# EAGLE design Lichtobjekt (EAGLE 7.5.0)

## Sheet 1 of 2
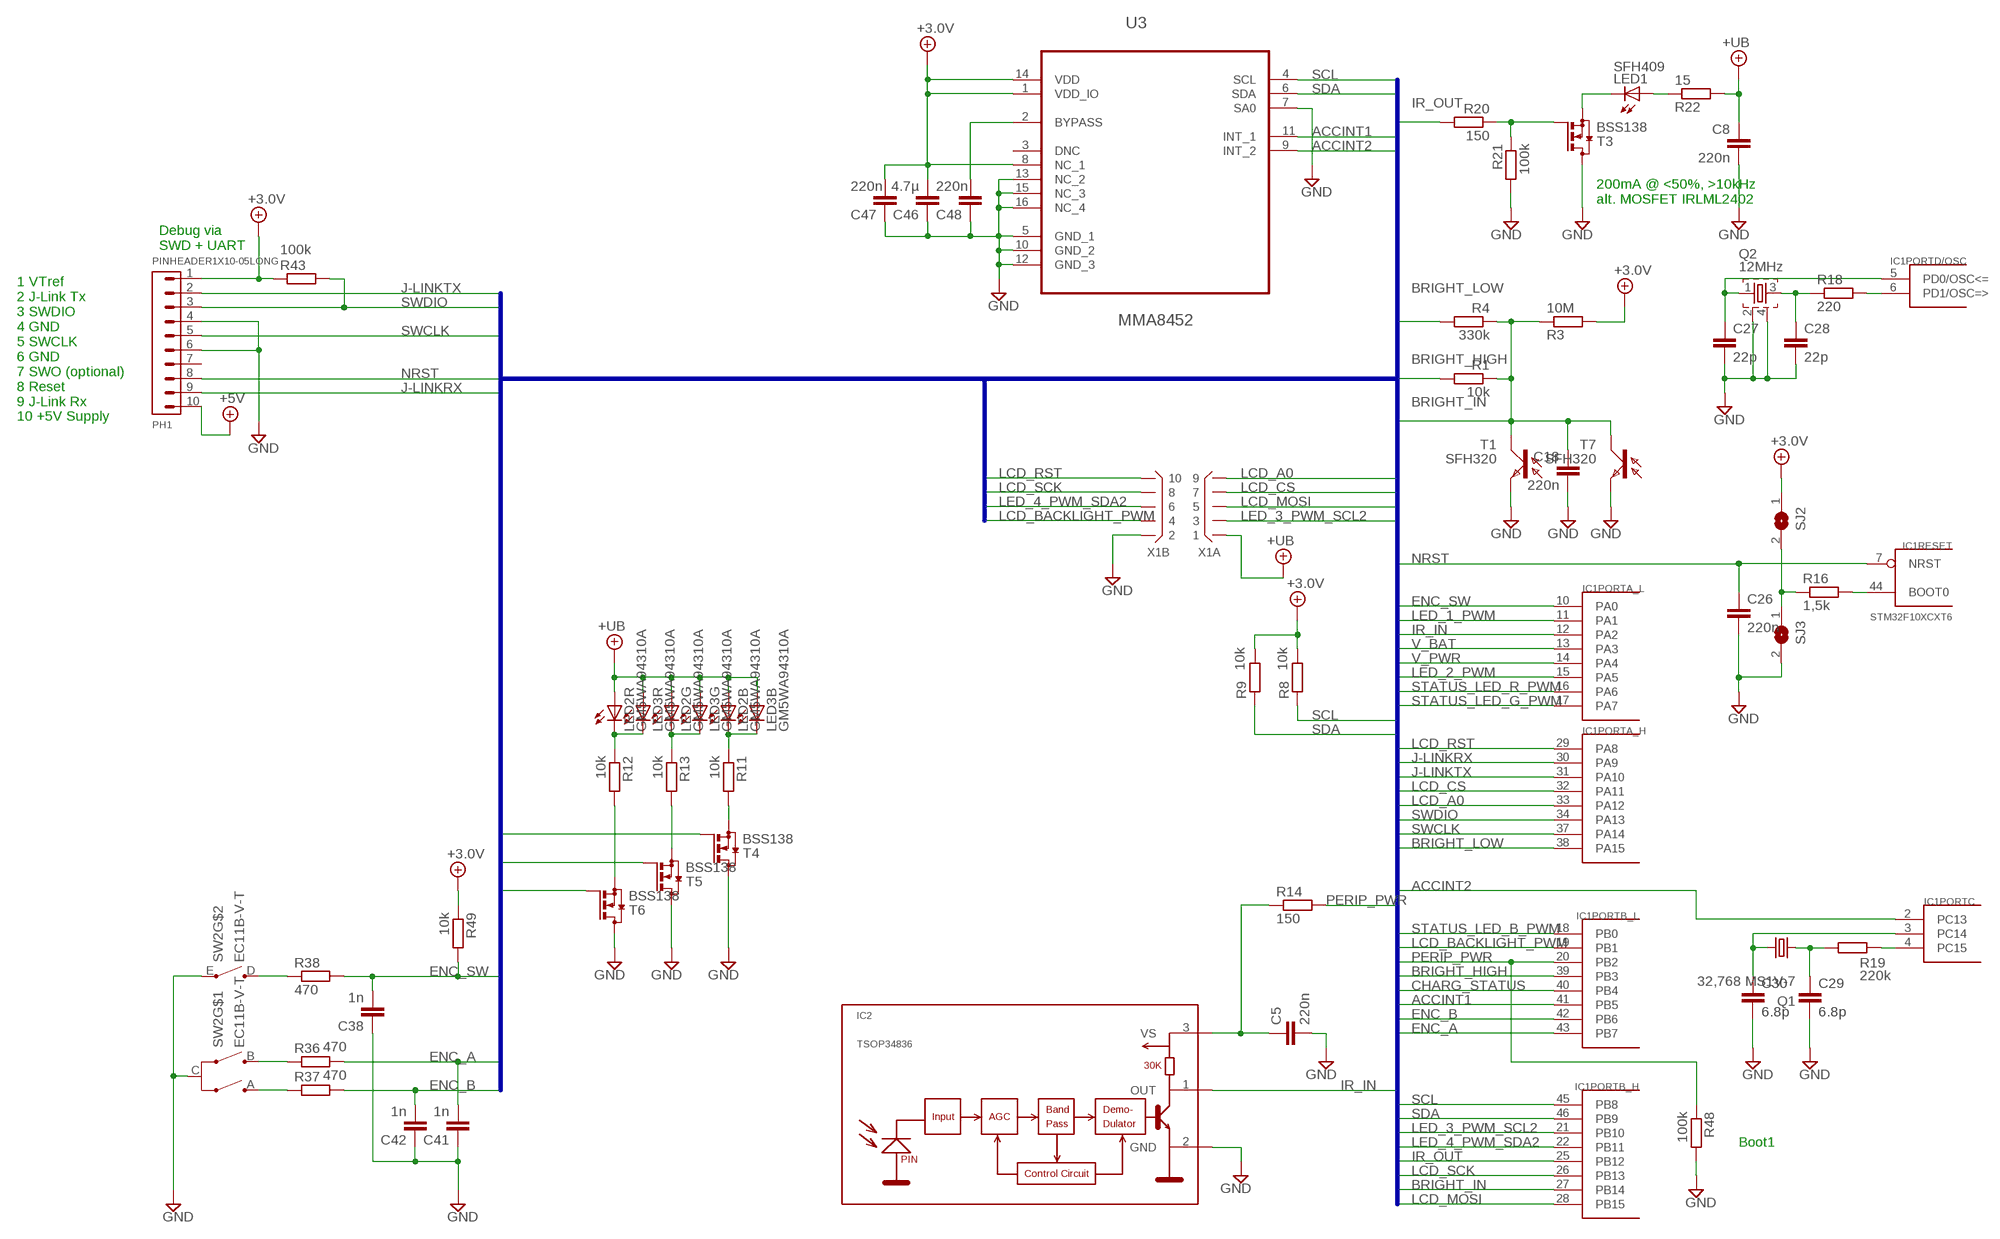
[diagram p0: schematic, sheet 1]

### Parts
C5  220n  C-EUC0603  [C0603]
C8  220n  C-EUC0603  [C0603]
C18  220n  C-EUC0603  [C0603]
C26  220n  C-EUC0603  [C0603]
C27  22p  C-EUC0603  [C0603]
C28  22p  C-EUC0603  [C0603]
C29  6.8p  C-EUC0603  [C0603]
C30  6.8p  C-EUC0603  [C0603]
C38  1n  C-EUC0603  [C0603]
C41  1n  C-EUC0603  [C0603]
C42  1n  C-EUC0603  [C0603]
C46  4.7µ  C-EUC0805  [C0805]
C47  220n  C-EUC0603  [C0603]
C48  220n  C-EUC0603  [C0603]
IC1  STM32F10XCXT6  [TQFP48]
IC2  TSOP34836  [TSOP348]
LED1  SFH409  LED3MM  [LED3MM]
LED2  GM5WA94310A  [GM5WA94310A]
LED3  GM5WA94310A  [GM5WA94310A]
PH1  PINHEADER1X10-05LONG  [PINHEADER_005-1-10]
Q1  32,768 MS1V-7  MS1V-T1K  [MS1V-T1K]
Q2  12MHz  CRYSTALS-GND-LID-CFPX-180  [3.4X2.7-4-PAD]
R1  10k  R-EU_R0805  [R0805]
R3  10M  R-EU_R0805  [R0805]
R4  330k  R-EU_R0805  [R0805]
R8  10k  R-EU_R0805  [R0805]
R9  10k  R-EU_R0805  [R0805]
R11  10k  R-EU_R0805  [R0805]
R12  10k  R-EU_R0805  [R0805]
R13  10k  R-EU_R0805  [R0805]
R14  150  R-EU_R0805  [R0805]
R16  1,5k  R-EU_R0805  [R0805]
R18  220  R-EU_R0805  [R0805]
R19  220k  R-EU_R0805  [R0805]
R20  150  R-EU_R0805  [R0805]
R21  100k  R-EU_R0805  [R0805]
R22  15  R-EU_R1206  [R1206]
R36  470  R-EU_R0805  [R0805]
R37  470  R-EU_R0805  [R0805]
R38  470  R-EU_R0805  [R0805]
R43  100k  R-EU_R0805  [R0805]
R48  100k  R-EU_R0805  [R0805]
R49  10k  R-EU_R0805  [R0805]
SJ2  SJ  [SJ]
SJ3  SJ  [SJ]
SW2  EC11B-V-T  [EC11B-V]
T1  SFH320  [PLCC2]
T3  BSS138  [SOT23]
T4  BSS138  [SOT23]
T5  BSS138  [SOT23]
T6  BSS138  [SOT23]
T7  SFH320  [PLCC2]
U3  MMA8452  [LGA16R50P3X5_300X300X100]
X1  X05X2  [X10N-IDC]

### Nets
+5V: PH1.10 ; also sheet 2
+UB: C8.1 LED2.1(B:A) LED2.2(R:A) LED2.3(G:A) LED3.1(B:A) LED3.2(R:A) LED3.3(G:A) R22.2 X1.1 ; also sheet 2
+UB3: C46.2 C47.1 PH1.1 R3.2 R8.2 R9.2 R43.1 R49.1 SJ2.1 U3.1(VDD_IO) U3.8(NC_1) U3.14(VDD) ; supply symbol labelled +3.0V ; also sheet 2
ACCINT1: IC1.41(PORTB_L:PB5) U3.11(INT_1)
ACCINT2: IC1.2(PORTC:PC13) U3.9(INT_2)
BRIGHT_HIGH: IC1.39(PORTB_L:PB3) R1.2
BRIGHT_IN: C18.1 IC1.27(PORTB_H:PB14) R1.1 R3.1 R4.1 T1.A(C) T7.A(C)
BRIGHT_LOW: IC1.38(PORTA_H:PA15) R4.2
CHARG_STATUS: IC1.40(PORTB_L:PB4) ; also sheet 2
ENC_A: C41.2 IC1.43(PORTB_L:PB7) R36.2
ENC_B: C42.2 IC1.42(PORTB_L:PB6) R37.2
ENC_SW: C38.2 IC1.10(PORTA_L:PA0) R38.2 R49.2
GND: C5.2 C8.2 C18.2 C26.2 C27.2 C28.2 C29.2 C30.2 C38.1 C41.1 C42.1 C46.1 C47.2 C48.2 IC2.2(GND) PH1.4 PH1.6 Q2.2 Q2.4 R21.2 R48.2 SJ3.2 SW2.C SW2.E T1.C(E) T3.3(D) T4.3(D) T5.3(D) T6.3(D) T7.C(E) U3.5(GND_1) U3.7(SA0) U3.10(GND_2) U3.12(GND_3) U3.13(NC_2) U3.15(NC_3) U3.16(NC_4) X1.2 ; also sheet 2
IR_IN: IC1.12(PORTA_L:PA2) IC2.1(OUT)
IR_OUT: IC1.25(PORTB_H:PB12) R20.2
J-LINKRX: IC1.30(PORTA_H:PA9) PH1.9
J-LINKTX: IC1.31(PORTA_H:PA10) PH1.2
LCD_A0: IC1.33(PORTA_H:PA12) X1.9
LCD_BACKLIGHT_PWM: IC1.19(PORTB_L:PB1) X1.4
LCD_CS: IC1.32(PORTA_H:PA11) X1.7
LCD_MOSI: IC1.28(PORTB_H:PB15) X1.5
LCD_RST: IC1.29(PORTA_H:PA8) X1.10
LCD_SCK: IC1.26(PORTB_H:PB13) X1.8
LED_1_PWM: IC1.11(PORTA_L:PA1) ; also sheet 2
LED_2_PWM: IC1.15(PORTA_L:PA5) ; also sheet 2
LED_3_PWM_SCL2: IC1.21(PORTB_H:PB10) X1.3
LED_4_PWM_SDA2: IC1.22(PORTB_H:PB11) X1.6
N$6: R11.2 T4.2(S)
N$10: R13.2 T5.2(S)
N$11: R12.2 T6.2(S)
N$14: LED2.5(R:C) LED3.5(R:C) R12.1
N$15: LED2.4(G:C) LED3.4(G:C) R13.1
N$16: LED2.6(B:C) LED3.6(B:C) R11.1
N$17: C5.1 IC2.3(VS) R14.1
N$23: C48.1 U3.2(BYPASS)
N$26: R16.1 SJ2.2 SJ3.1
N$27: IC1.44(RESET:BOOT0) R16.2
N$28: C28.1 Q2.3 R18.1
N$30: IC1.6(PORTD/OSC:PD1/OSC=>) R18.2
N$31: C27.1 IC1.5(PORTD/OSC:PD0/OSC<=) Q2.1
N$32: C30.1 IC1.3(PORTC:PC14) Q1.4
N$33: C29.1 Q1.1 R19.1
N$34: IC1.4(PORTC:PC15) R19.2
N$35: R20.1 R21.1 T3.1(G)
N$37: LED1.K(C) T3.2(S)
N$39: LED1.A R22.1
N$74: R38.1 SW2.D
N$75: R36.1 SW2.B
N$76: R37.1 SW2.A
NRST: C26.1 IC1.7(RESET:NRST) PH1.8
PERIP_PWR: IC1.20(PORTB_L:PB2) R14.2 R48.1 ; also sheet 2
SCL: IC1.45(PORTB_H:PB8) R8.1 U3.4(SCL)
SDA: IC1.46(PORTB_H:PB9) R9.1 U3.6(SDA)
STATUS_LED_B_PWM: IC1.18(PORTB_L:PB0) T4.1(G)
STATUS_LED_G_PWM: IC1.17(PORTA_L:PA7) T6.1(G)
STATUS_LED_R_PWM: IC1.16(PORTA_L:PA6) T5.1(G)
SWCLK: IC1.37(PORTA_H:PA14) PH1.5
SWDIO: IC1.34(PORTA_H:PA13) PH1.3 R43.2
V_BAT: IC1.13(PORTA_L:PA3) ; also sheet 2
V_PWR: IC1.14(PORTA_L:PA4) ; also sheet 2
Unconnected: PH1.7

### Buses
B$1

### Notes on the sheet
- 200mA @ <50%, >10kHz
  alt. MOSFET IRLML2402
- Debug via
  SWD + UART
- 1 VTref
  2 J-Link Tx
  3 SWDIO
  4 GND
  5 SWCLK
  6 GND
  7 SWO (optional)
  8 Reset
  9 J-Link Rx
  10 +5V Supply
- Boot1

## Sheet 2 of 2
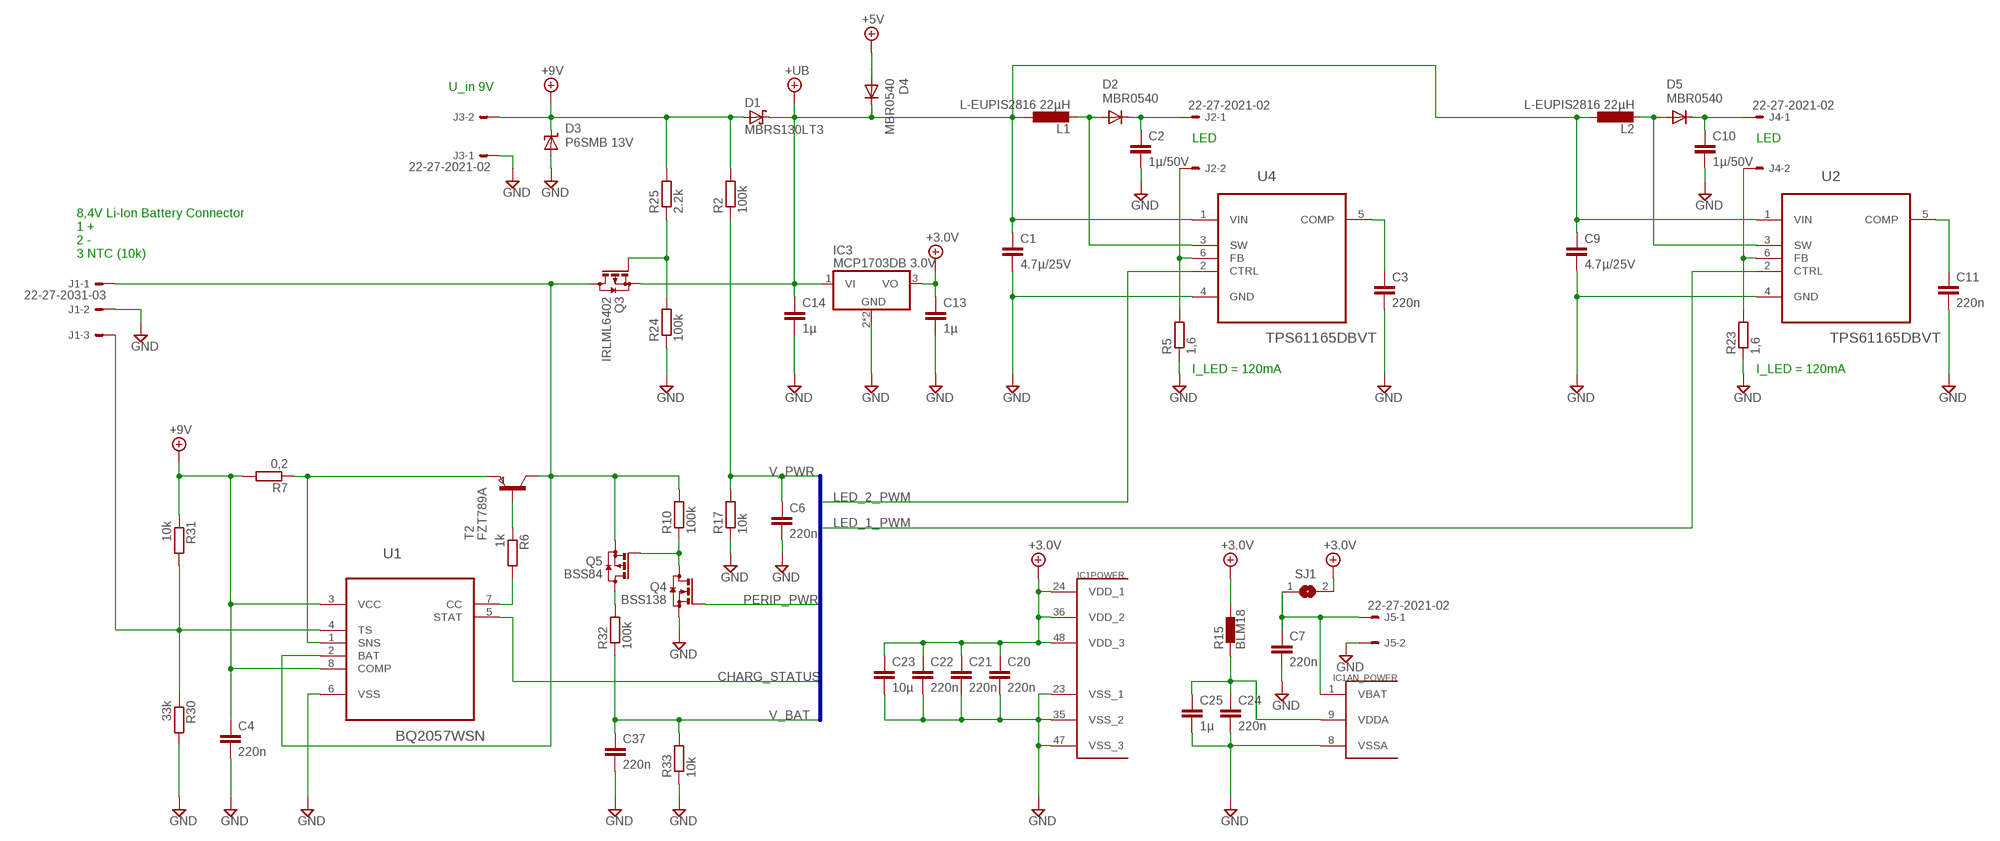
[diagram p1: schematic, sheet 2]

### Parts
C1  4.7µ/25V  C-EUC0805  [C0805]
C2  1µ/50V  C-EUC0805  [C0805]
C3  220n  C-EUC0603  [C0603]
C4  220n  C-EUC0603  [C0603]
C6  220n  C-EUC0603  [C0603]
C7  220n  C-EUC0603  [C0603]
C9  4.7µ/25V  C-EUC0805  [C0805]
C10  1µ/50V  C-EUC0805  [C0805]
C11  220n  C-EUC0603  [C0603]
C13  1µ  C-EUC0805  [C0805]
C14  1µ  C-EUC0805  [C0805]
C20  220n  C-EUC0603  [C0603]
C21  220n  C-EUC0603  [C0603]
C22  220n  C-EUC0603  [C0603]
C23  10µ  C-EUC0805  [C0805]
C24  220n  C-EUC0603  [C0603]
C25  1µ  C-EUC0805  [C0805]
C37  220n  C-EUC0603  [C0603]
D1  MBRS130LT3  [SMB]
D2  MBR0540  MBR0520LT  [SOD123]
D3  P6SMB 13V  SUPPRESSOR-SMBG  [SMBG]
D4  MBR0540  MBR0520LT  [SOD123]
D5  MBR0540  MBR0520LT  [SOD123]
IC3  MCP1703DB 3.0V  MCP1703DB  [SOT223]
J1  22-27-2031-03  [6410-03]
J2  22-27-2021-02  [6410-02]
J3  22-27-2021-02  [6410-02]
J4  22-27-2021-02  [6410-02]
J5  22-27-2021-02  [6410-02]
L1  L-EUPIS2816 22µH  L-EUPIS28XX  [PIS28XX]
L2  L-EUPIS2816 22µH  L-EUPIS28XX  [PIS28XX]
Q3  IRLML6402  [SOT23]
Q4  BSS138  [SOT23]
Q5  BSS84  [SOT23]
R2  100k  R-EU_R0805  [R0805]
R5  1,6  R-EU_R1206  [R1206]
R6  1k  R-EU_R0805  [R0805]
R7  0,2  R-EU_R1206  [R1206]
R10  100k  R-EU_R0805  [R0805]
R15  BLM18  [R0805]
R17  10k  R-EU_R0805  [R0805]
R23  1,6  R-EU_R1206  [R1206]
R24  100k  R-EU_R0805  [R0805]
R25  2.2k  R-EU_R0805  [R0805]
R30  33k  R-EU_R0805  [R0805]
R31  10k  R-EU_R0805  [R0805]
R32  100k  R-EU_R0805  [R0805]
R33  10k  R-EU_R0805  [R0805]
SJ1  SJ  [SJ]
T2  FZT789A  [SOT223]
U1  BQ2057WSN  [SOIC127P600X175-8N]
U2  TPS61165DBVT  [SOT95P280X145-6N]
U4  TPS61165DBVT  [SOT95P280X145-6N]

### Nets
+5V: D4.A ; also sheet 1
+9V: C4.1 D1.A D3.C J3.2 R2.2 R7.2 R25.2 R31.1 U1.3(VCC) U1.8(COMP)
+UB: C1.1 C9.1 C14.1 D1.C D4.C IC3.1(VI) L1.2 L2.2 Q3.2(S) U2.1(VIN) U4.1(VIN) ; also sheet 1
+UB3: C13.1 C20.1 C21.1 C22.1 C23.1 IC1.24(POWER:VDD_1) IC1.36(POWER:VDD_2) IC1.48(POWER:VDD_3) IC3.3(VO) R15.2 SJ1.2 ; supply symbol labelled +3.0V ; also sheet 1
CHARG_STATUS: U1.5(STAT) ; also sheet 1
GND: C1.2 C2.2 C3.2 C4.2 C6.2 C7.2 C9.2 C10.2 C11.2 C13.2 C14.2 C20.2 C21.2 C22.2 C23.2 C24.2 C25.2 C37.2 D3.A IC1.8(AN_POWER:VSSA) IC1.23(POWER:VSS_1) IC1.35(POWER:VSS_2) IC1.47(POWER:VSS_3) IC3.2(GND) IC3.4(GND) J1.2 J3.1 J5.2 Q4.2(S) R5.1 R17.1 R23.1 R24.1 R30.2 R33.1 U1.6(VSS) U2.4(GND) U4.4(GND) ; also sheet 1
LED_1_PWM: U2.2(CTRL) ; also sheet 1
LED_2_PWM: U4.2(CTRL) ; also sheet 1
N$1: C3.1 U4.5(COMP)
N$2: Q5.3(D) R32.2
N$3: J2.2 R5.2 U4.6(FB)
N$4: D2.A L1.1 U4.3(SW)
N$5: C2.1 D2.C J2.1
N$7: R7.1 T2.3(E) U1.1(SNS)
N$8: R6.1 T2.1(B)
N$9: R6.2 U1.7(CC)
N$12: Q4.3(D) Q5.1(G) R10.1
N$13: J1.1 Q3.3(D) Q5.2(S) R10.2 T2.2(C) T2.4(C) U1.2(BAT)
N$19: C7.1 IC1.1(AN_POWER:VBAT) J5.1 SJ1.1
N$20: C11.1 U2.5(COMP)
N$21: J4.2 R23.2 U2.6(FB)
N$22: C24.1 C25.1 IC1.9(AN_POWER:VDDA) R15.1
N$24: D5.A L2.1 U2.3(SW)
N$25: C10.1 D5.C J4.1
N$41: Q3.1(G) R24.2 R25.1
N$48: J1.3 R30.1 R31.2 U1.4(TS)
PERIP_PWR: Q4.1(G) ; also sheet 1
V_BAT: C37.1 R32.1 R33.2 ; also sheet 1
V_PWR: C6.1 R2.1 R17.2 ; also sheet 1

### Buses
B$1

### Notes on the sheet
- U_in 9V
- LED | LED
- 8,4V Li-Ion Battery Connector
  1 +
  2 -
  3 NTC (10k)
- I_LED = 120mA | I_LED = 120mA

## Power pins joined to a net without a drawn wire
DNC: U3.3(DNC)

## Library data of the parts
C1-C11 C13 C14 C18 C20-C30 C37 C38 C41 C42 C46-C48 = rcl:C-EU: CAPACITOR, European symbol
D1 = diode:MBRS130LT3: Schottky Power Rectifier Source: http://www.onsemi.com/pub/Collateral/MBRS130LT3-D.PDF
D2 D4 D5 = diode:MBR0520LT: SCHOTTKY BARRIER RECTIFIER Source: http://onsemi.com .. MBR0520LT1-D.pdf
D3 = diode:SUPPRESSOR-: Suppressor diode
IC1 = stm32:STM32F10XCXT6: ST STM32F101/103 48pin LQFP
IC2 = vishay-1:TSOP348*: IR Receiver Modules for Remote Control Systems http://www.vishay.com/ir-receiver-modules/
IC3 = linear:MCP1703: 250 mA, 16V, Low Quiescent Current LDO Regulator Source: http://ww1.microchip.com/downloads/en/DeviceDoc/22049b.pdf
J1 = con-molex:22-?-03: CONNECTOR wire to board 2.54 mm (.1 inch) pitch header; OC_FARNELL: unknown; OC_NEWARK: unknown
J2-J5 = con-molex:22-?-02: CONNECTOR wire to board 2.54 mm (.1 inch) pitch header; OC_FARNELL: unknown; OC_NEWARK: unknown
L1 L2 = Inductor-Fastron (2):L-EU
LED1 = led:LED: LED OSRAM: - CHIPLED LG R971, LG N971, LY N971, LG Q971, LY Q971, LO R971, LY R971 LH N974, LH R974 LS Q976, LO Q976, LY Q976 LO Q996 - Hyper CHIPLED LW Q18S LB Q993, LB Q99A, LB R99A - SideLED LS A670, LO A670, LY A670, LG A670, LP A670 LB A673, LV A673, LT A673, LW A673 LH A674 LY A675 LS A676, LA A676, LO A676, LY A676, LW A676 LS A679, LY A679, LG A679 - Hyper Micro SIDELED® LS Y876, LA Y876, LO Y876, LY Y876 LT Y87S - SmartLED LW L88C, LW L88S LB L89C, LB L89S, LG L890 LS L89K, LO L89K, LY L89K LS L896, LA L896, LO L896, LY L896 - TOPLED LS T670, LO T670, LY T670, LG T670, LP T670 LSG T670, LSP T670, LSY T670, LOP T670, LYG T670 LG T671, LOG T671, LSG T671 LB T673, LV T673, LT T673, LW T673 LH T674 LS T676, LA T676, LO T676, LY T676, LB T676, LH T676, LSB T676, LW T676 LB T67C, LV T67C, LT T67C, LS T67K, LO T67K, LY T67K, LW E67C LS E67B, LA E67B, LO E67B, LY E67B, LB E67C, LV E67C, LT E67C LW T67C LS T679, LY T679, LG T679 LS T770, LO T770, LY T770, LG T770, LP T770 LB T773, LV T773, LT T773, LW T773 LH T774 LS E675, LA E675, LY E675, LS T675 LS T776, LA T776, LO T776, LY T776, LB T776 LHGB T686 LT T68C, LB T68C - Hyper Mini TOPLED® LB M676 - Mini TOPLED Santana® LG M470 LS M47K, LO M47K, LY M47K Source: http://www.osram.convergy.de LUXEON: - LUMILED® LXK2-PW12-R00, LXK2-PW12-S00, LXK2-PW14-U00, LXK2-PW14-V00 LXK2-PM12-R00, LXK2-PM12-S00, LXK2-PM14-U00 LXK2-PE12-Q00, LXK2-PE12-R00, LXK2-PE12-S00, LXK2-PE14-T00, LXK2-PE14-U00 LXK2-PB12-K00, LXK2-PB12-L00, LXK2-PB12-M00, LXK2-PB14-N00, LXK2-PB14-P00, LXK2-PB14-Q00 LXK2-PR12-L00, LXK2-PR12-M00, LXK2-PR14-Q00, LXK2-PR14-R00 LXK2-PD12-Q00, LXK2-PD12-R00, LXK2-PD12-S00 LXK2-PH12-R00, LXK2-PH12-S00 LXK2-PL12-P00, LXK2-PL12-Q00, LXK2-PL12-R00 Source: www.luxeon.com KINGBRIGHT: KA-3528ASYC Source: www.kingbright.com
LED2 LED3 = led:GM5WA94310A: Chip LED RGB Source: http://document.sharpsma.com/files/GM5WA94310A_SS.pdf
PH1 = Martin:PINHEADER1X10
Q1 = Teatimer:MS1V-T1K: kHz RANGE CRYSTAL UNIT SMD MS1V-T1K; MF: BANNER ENGINEERING CORPORATION; MPN: MQDMC-406; OC_FARNELL: 1216226; OC_NEWARK: 21H2317
Q2 = IQD-Frequency-Products:CRYSTALS-GND-LID: CRYSTALS WITH CAN GROUNDED
Q3 = Martin:IRLML6402: P-CHANNEL MOS FET
Q4 T3-T6 = Martin:BSS138: N-CHANNEL MOS FET
Q5 = transistor-small-signal:BSS84: P-CHANNEL MOS FET
R1-R14 R16-R25 R30-R33 R36-R38 R43 R48 R49 = rcl:R-EU_: RESISTOR, European symbol
R15 = Teatimer:BLM18: EMIFIL (R) Chip Ferrite Bead for GHz Noise murata.com Ferrite Bead BLM18
SJ1-SJ3 = jumper:SJ: SMD solder JUMPER
SW2 = alps:EC11B-V-T: ALPS EC11B Vertikal mit Taster Drehimpulsgeber 11mm
T1 T7 = opto2:SFH320: PHOTO TRANSISTOR
T2 = zetex:FZT789A: PNP TRANSISTOR; MPN: FZT789A; OC_FARNELL: 9526633; OC_NEWARK: 97K0407
U1 = Texas Instruments_By_element14_Batch_1:BQ2057WSN: Charge management IC; MPN: BQ2057WSN; OC_FARNELL: 1212263; OC_NEWARK: 74C7600; PACKAGE: SOIC-8; SUPPLIER: Texas Instruments
U2 U4 = Texas Instruments_By_element14_Batch_1:TPS61165DBVT: High Brightness White LED Driver; MPN: TPS61165DBVT; OC_FARNELL: -; OC_NEWARK: 79R8564; PACKAGE: SOT-23-6; SUPPLIER: Texas Instruments
U3 = Martin:MMA8452: MEMS motion sensor; PACKAGE: LGA-16; SUPPLIER: NXP
X1 = connectors:X05X2: Connector 2x5 pins

## Board
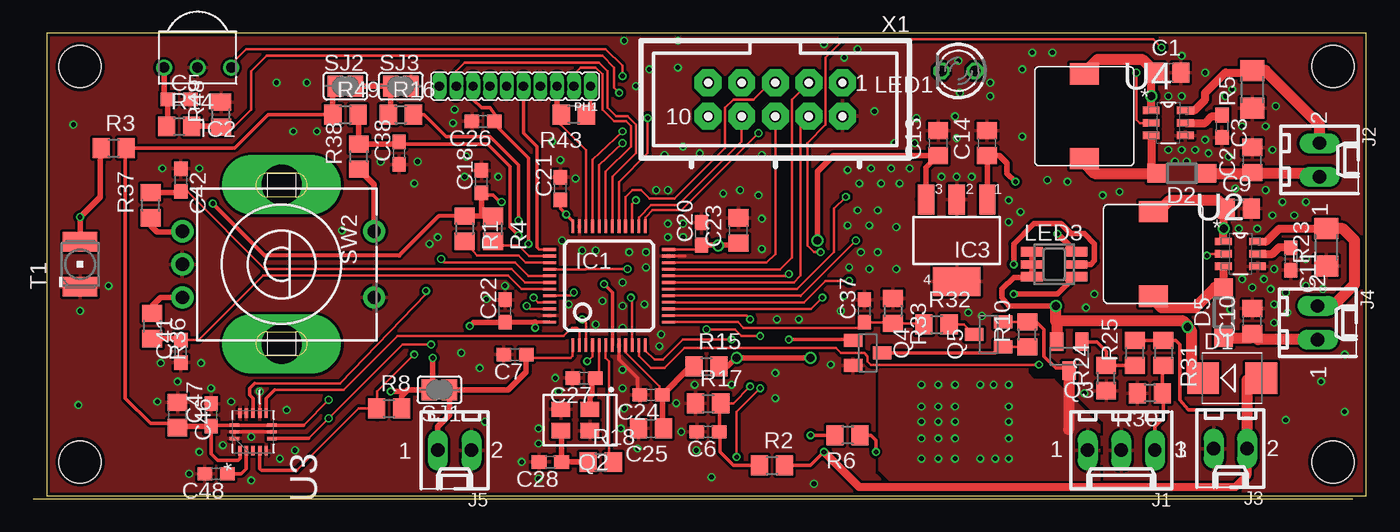
[diagram p2: board, top side]
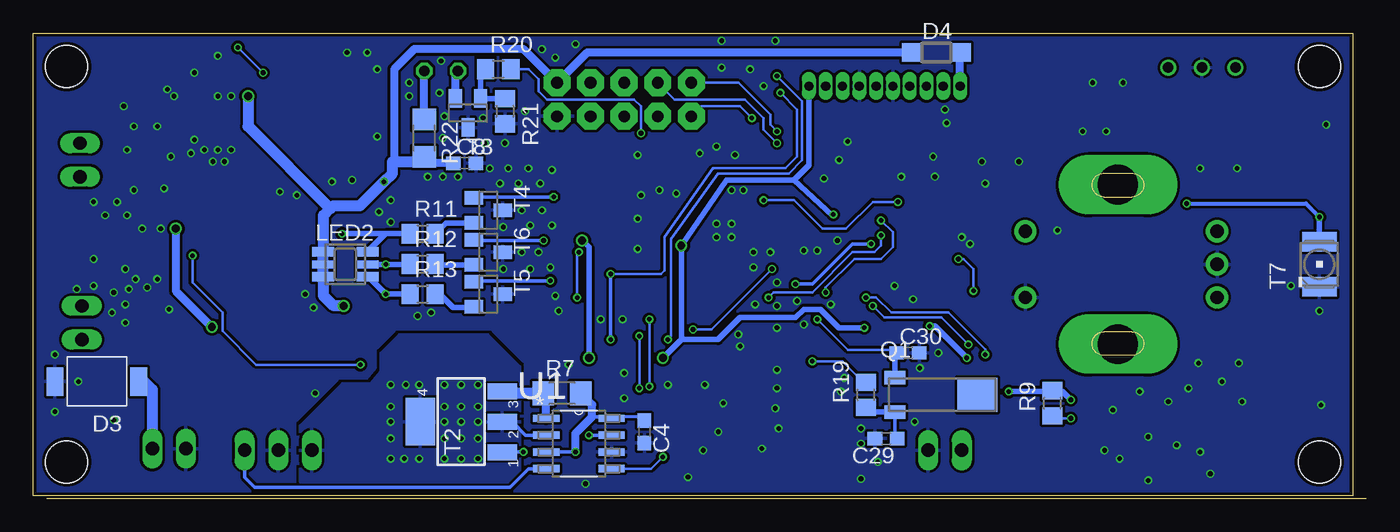
[diagram p3: board, bottom side, seen from below]

Size 100.84 x 35.26 mm. Coordinates in mm from the lower left corner, seen from the top.
Outline: 0,0 99.82,0
Outline: 1.02,0.25 100.84,0.25 100.84,35.25 1.02,35.25 1.02,0.25
Copper layers (1*16): Top 0.018mm / dielectric 1.55mm / Bottom 0.018mm
Design rules "eC_2Layer_PClass6_BaseCopperO18_eCDefault *": minimum track width 0.15mm, minimum drill 0.35mm, track to track 0.15mm, track to pad 0.15mm, pad to pad 0.15mm, via to via 0.15mm, smd to smd 0mil, copper to edge 0.25mm, drill to drill 0.35mm, minimum pad ring 0.175mm, minimum via ring 0.125mm, stop-mask expansion 0mil, vias tented up to drill 0.45mm, thermal gap 0.2mm
Holes 3.2 mm at 3.56,2.79 3.56,32.72 98.3,32.72 98.3,2.79

### Footprints (pad centres in the part's own frame; a part is rotated, then mirrored left to right if it is on the bottom)
C0805 = smd 1.3 x 1.5: 1 -0.95,0; 2 0.95,0
C0603 = smd 1.1 x 1: 1 -0.85,0; 2 0.85,0
SMB = smd 2.4 x 2.4: A 2.2,0; C -2.2,0
SOD123 = smd 1.4 x 1.4: A 1.9,0; C -1.9,0
SMBG = smd 1.27 x 2.16: A 3.17,0; C -3.17,0
TQFP48 = smd 0.2 x 1: 1 -2.75,-4.5; 2 -2.25,-4.5; 3 -1.75,-4.5; 4 -1.25,-4.5; 5 -0.75,-4.5; 6 -0.25,-4.5; 7 0.25,-4.5; 8 0.75,-4.5; 9 1.25,-4.5; 10 1.75,-4.5; 11 2.25,-4.5; 12 2.75,-4.5; 25 2.75,4.5; 26 2.25,4.5; 27 1.75,4.5; 28 1.25,4.5; 29 0.75,4.5; 30 0.25,4.5; 31 -0.25,4.5; 32 -0.75,4.5; 33 -1.25,4.5; 34 -1.75,4.5; 35 -2.25,4.5; 36 -2.75,4.5 | smd 1 x 0.2: 13 4.5,-2.75; 14 4.5,-2.25; 15 4.5,-1.75; 16 4.5,-1.25; 17 4.5,-0.75; 18 4.5,-0.25; 19 4.5,0.25; 20 4.5,0.75; 21 4.5,1.25; 22 4.5,1.75; 23 4.5,2.25; 24 4.5,2.75; 37 -4.5,2.75; 38 -4.5,2.25; 39 -4.5,1.75; 40 -4.5,1.25; 41 -4.5,0.75; 42 -4.5,0.25; 43 -4.5,-0.25; 44 -4.5,-0.75; 45 -4.5,-1.25; 46 -4.5,-1.75; 47 -4.5,-2.25; 48 -4.5,-2.75
TSOP348 = drill 0.8: 1 -2.54,0; 2 0,0; 3 2.54,0
SOT223 = smd 1.219 x 2.235: 1 -2.311,-3.099; 2 0,-3.099; 3 2.311,-3.099 | smd 3.6 x 2.2: 4 0,3.099
6410-03 = drill 1.016 long: 1 2.54,0; 2 0,0; 3 -2.54,0
6410-02 = drill 1.016 long: 1 1.27,0; 2 -1.27,0
PIS28XX = smd 1.6 x 2.2: 1 -3.2,0; 2 3.2,0
LED3MM = drill 0.813 octagon: A -1.27,0; K 1.27,0
GM5WA94310A = smd 0.7 x 1.65: 1 -0.95,-1.675; 3 0.95,-1.675; 4 0.95,1.675; 6 -0.95,1.675 | smd 0.6 x 1.65: 2 0,-1.675; 5 0,1.675
PINHEADER_005-1-10 = drill 0.7 pad 1.016 long: 1 0,0; 2 1.27,0; 3 2.54,0; 4 3.81,0; 5 5.08,0; 6 6.35,0; 7 7.62,0; 8 8.89,0; 9 10.16,0; 10 11.43,0
MS1V-T1K = smd 1.6 x 1: 1 -2.901,-1.3; 4 -2.901,1.3 | smd 3 x 2.54: 3 3.35,0
3.4X2.7-4-PAD = smd 1.4 x 1.15: 1 -1.1,-0.8; 2 1.1,-0.8; 3 1.1,0.8; 4 -1.1,0.8
SOT23 = smd 1 x 1.4: 1 -0.95,-1.1; 2 0.95,-1.1; 3 0,1.1
R0805 = smd 1.3 x 1.5: 1 -0.95,0; 2 0.95,0
R1206 = smd 1.6 x 1.803: 1 -1.422,0; 2 1.422,0
SJ = smd 1.168 x 1.6: 1 -0.762,0; 2 0.762,0
EC11B-V = drill 1 pad 1.676: A -2.5,-7.5; B 2.5,-7.5; C 0,-7.5; D -2.5,7; E 2.5,7 | drill 3 pad 3.3 long: G1 -6.032,0; G2 6.032,0
PLCC2 = smd 2.6 x 1.5: A 0,1.7; C 0,-1.7
SOIC127P600X175-8N = smd 1.981 x 0.559: 1 -2.464,1.905; 2 -2.464,0.635; 3 -2.464,-0.635; 4 -2.464,-1.905; 5 2.464,-1.905; 6 2.464,-0.635; 7 2.464,0.635; 8 2.464,1.905
SOT95P280X145-6N = smd 1.27 x 0.559: 1 -1.295,0.94; 2 -1.295,0; 3 -1.295,-0.94; 4 1.295,-0.94; 5 1.295,0; 6 1.295,0.94
LGA16R50P3X5_300X300X100 = smd 0.711 x 0.254: 1 -1.422,0.991; 2 -1.422,0.508; 3 -1.422,0; 4 -1.422,-0.508; 5 -1.422,-0.991; 9 1.422,-0.991; 10 1.422,-0.508; 11 1.422,0; 12 1.422,0.508; 13 1.422,0.991 | smd 0.254 x 0.711: 6 -0.508,-1.422; 7 0,-1.422; 8 0.508,-1.422; 14 0.508,1.422; 15 0,1.422; 16 -0.508,1.422
X10N-IDC = drill 0.889 pad 2.032 octagon: 1 -5.08,-1.27; 2 -5.08,1.27; 3 -2.54,-1.27; 4 -2.54,1.27; 5 0,-1.27; 6 0,1.27; 7 2.54,-1.27; 8 2.54,1.27; 9 5.08,-1.27; 10 5.08,1.27

### Placement (x,y rotation side)
C1  85.85,32.26 0 top
C2  92.2,25.65 90 top
C3  89.92,28.19 270 top
C4  54.61,5.08 270 bottom
C5  11.05,30.23 0 top
C6  51.05,5.08 180 top
C7  36.45,10.92 180 top
C8  68.2,25.4 0 bottom
C9  91.19,21.97 0 top
C10  92.2,13.46 90 top
C11  95.12,18.16 270 top
C13  68.45,26.92 90 top
C14  72.14,26.92 90 top
C18  33.91,24 90 top
C20  50.55,20.07 90 top
C21  39.88,23.5 90 top
C22  35.69,14.22 90 top
C23  53.34,20.32 90 top
C24  46.74,7.87 180 top
C25  46.74,5.33 180 top
C26  34.04,28.58 180 top
C27  41.66,9.14 180 top
C28  39.12,2.79 180 top
C29  36.32,4.57 180 bottom
C30  34.67,11.05 0 bottom
C37  62.86,14.22 90 top
C38  27.69,26.16 90 top
C41  11.18,11.18 90 top
C42  11.18,24.13 270 top
C46  10.92,6.35 270 top
C47  13.46,6.35 90 top
C48  13.84,1.91 180 top
D1  90.68,9.14 0 top
D2  86.87,24.64 180 top
D3  96.01,8.89 180 bottom
D4  32.51,33.78 0 bottom
D5  90.04,14.1 90 top
IC1  43.56,16.13 0 top
IC2  12.45,32.64 180 top
IC3  69.85,19.56 180 top
J1  82.3,3.68 180 top
J2  97.28,25.65 270 top
J3  90.55,3.81 180 top
J4  97.16,13.33 270 top
J5  31.88,3.68 180 top
L1  79.5,28.96 90 top
L2  84.71,18.54 90 top
LED1  69.98,32.38 180 top
LED2  77.22,17.75 270 bottom
LED3  77.22,17.75 270 top
PH1  42.16,31.24 180 top
Q1  32.77,7.87 0 bottom
Q2  41.02,5.97 180 top
Q3  78.36,10.79 180 top
Q4  63.12,11.05 270 top
Q5  72.26,12.45 90 top
R1  32.64,20.45 270 top
R2  55.88,2.54 0 top
R3  6.1,26.54 0 top
R4  34.8,20.45 270 top
R5  92.2,30.99 90 top
R6  61.59,4.83 180 top
R7  60.83,8 0 bottom
R8  26.92,6.86 0 top
R9  23.75,7.24 90 bottom
R10  75.18,12.45 90 top
R11  71.37,20.07 0 bottom
R12  71.37,17.78 0 bottom
R13  71.37,15.49 0 bottom
R14  11.05,28.19 0 top
R15  50.93,10.03 0 top
R16  27.81,29.08 0 top
R17  51.05,7.24 0 top
R18  42.93,2.79 0 top
R19  37.85,7.87 90 bottom
R20  65.66,32.51 0 bottom
R21  65.15,29.34 270 bottom
R22  71.25,27.3 270 bottom
R23  97.79,19.05 90 top
R24  81.15,9.14 90 top
R25  83.31,11.05 90 top
R30  84.45,8 180 top
R31  85.47,11.05 270 top
R32  68.33,13.21 0 top
R33  65.02,14.22 270 top
R36  9.02,13.08 270 top
R37  8.89,22.23 90 top
R38  24.64,25.91 90 top
R43  40.89,29.08 180 top
R48  14.22,29.08 90 top
R49  23.62,29.08 0 top
SJ1  30.73,8.25 180 top
SJ2  23.62,31.24 0 top
SJ3  27.81,31.24 0 top
SW2  18.8,17.75 270 top
T1  3.56,17.75 0 top
T2  68.45,5.84 90 bottom
T3  67.95,29.21 180 bottom
T4  66.42,21.84 270 bottom
T5  66.42,15.49 270 bottom
T6  66.42,18.67 270 bottom
T7  3.56,17.75 0 bottom
U1  59.56,4.19 0 bottom
U2  91.31,18.54 0 top
U3  16.64,5.08 90 top
U4  85.85,28.45 0 top
X1  56.13,30.23 180 top

### Tracks (layer width: path | path; a pad name or v marks a point on that pad's centre or on a via)
+5V
  Bottom 0.61: PH1.10 30.73,33.66 D4.A
+9V  (via drill 0.35)
  Top 0.254: R2.2 58.8,2.54 v59.82,3.56 | R25.2 R31.1 86.43,12 86.74,11.68 86.74,7.49 87.38,6.73 91.69,6.73 91.82,6.6
  Top 0.61: v59.82,3.56 62.48,0.89 90.93,0.89 91.82,1.78 J3.2
  Top 0.813: J3.2 91.82,6.6 91.82,8.98 D1.A
  Bottom 0.254: 57.23,6.22 54.94,6.23 C4.1 | 58.55,6.22 57.23,6.22 | 57.23,6.22 U1.8 | U1.3 v59.82,3.56
  Bottom 0.61: v59.82,3.56 59.82,4.95 58.55,6.22 58.55,7.14 R7.2
  Bottom 0.813: D3.C 92.46,8.89 91.82,8.25 J3.2
+UB  (via drill 0.35, 0.6)
  Top 0.406: 84.56,31.91 C1.1 | LED3.3 LED3.2 LED3.1 75.54,16.87 75.44,16.76 74.17,16.76 73.28,15.88 73.28,15.24 73.79,14.61 v77.34,14.61 | IC3.1 72.16,25.95 C14.1 73.09,25.97 73.66,25.41 73.66,24.64 v74.3,24 | L2.2 85.12,21.74
  Top 0.61: U4.1 84.56,31.91 | 84.58,30.73 84.58,31.94 C1.1 | U4.1 84.56,30.2 v84.58,30.48 84.58,29.39 U4.1 | U2.1 90.02,20.42 v90.04,20.45 90.04,21.78 C9.1
  Top 0.813: L1.2 79.5,32.26 80.52,33.27 83.89,33.27 C1.1 | 85.12,21.74 85.98,22.61 89.6,22.61 C9.1 | 77.28,14.54 v77.34,14.61 77.34,13.46 77.41,13.46 | D1.C 87.63,9.53 87.63,12.7 v87.31,13.02 87.31,13.14 87,13.46 77.41,13.46 | L2.2 84.3,21.74 | 77.41,13.46 Q3.2
  Bottom 0.406: R22.2 71.35,25.78 71.35,25.5 71.25,25.4 | 78.87,16.78 LED2.3
  Bottom 0.61: C8.1 70.76,25.4 R22.2 | v90.04,20.45 90.04,15.75 v87.31,13.02 | D4.C 58.93,33.78 X1.1 63.75,34.04 72.01,34.04 73.53,32.51 73.53,25.53 73.66,25.41
  Bottom 0.813: LED2.3 LED2.2 LED2.1 78.87,18.8 78.87,21.46 78.36,21.97 | 78.36,21.97 78.14,22.19 76.11,22.19 v74.3,24 73.66,24.64 73.66,25.41 73.66,25.53 71.6,25.53 R22.2 | 78.87,16.78 78.87,15.37 78.11,14.61 v77.34,14.61 | v84.58,30.48 84.58,28.19 78.36,21.97
+UB3  (via drill 0.35, 0.35 pad 0.35, 0.6)
  Top 0.203: IC1.24 50.54,18.88 | C46.2 10.61,5.71 | IC1.36 40.81,21.04 | 52.73,19.22 C23.1 | 30.23,8.25 SJ1.2 | 20.45,5.59 v22.35,7.49 | 27.94,8.13 28.07,8
  Top 0.254: 37.98,13.38 IC1.48 38.02,13.38 37.97,13.33 | 50.54,18.88 C20.1 | 11.02,5.5 C46.2 | U3.1 15.65,3.07 15.49,2.92 13.97,2.92 13.46,3.43 C47.1 13.55,5.59 U3.14 U3.8 20.45,5.59 | 10.61,5.71 8.89,5.71 6.99,7.62 6.99,26.48 R3.2 15.24,26.54 17.78,29.08 R49.1 | PH1.1 42.16,28.89 R43.1 | 40.81,21.04 v40.32,21.53 39.88,21.97 C21.1 | v51.82,19.18 52.41,19.18 52.45,19.22
  Top 0.406: 37.98,13.38 C22.1 33.31,13.37 v33.02,13.08 | C47.1 11.02,5.5 | R49.1 22.67,31.05 SJ2.1 | R15.2 52.2,9.78 v53.21,10.67 v58.8,10.67 | 37.97,13.33 v37.97,12.95 | 67.11,22.66 IC3.3 67.54,25.06 C13.1 60.52,25.97 59.31,24.77 v59.31,19.56 | C20.1 52.45,19.22 52.73,19.22 | R8.2 27.87,7.81 28.07,8 28.32,8.25 SJ1.2 | v30.23,10.67 30.23,8.25 | v27.05,8.13 27.94,8.13
  Bottom 0.203: 22.99,8.13 23.81,8.13 R9.2
  Bottom 0.254: 40.39,21.46 v40.32,21.53
  Bottom 0.406: v53.21,10.67 51.82,12.06 | 51.82,12.06 v51.82,19.18 48.39,24.13 43.31,24.13 | v37.97,12.95 39.88,12.95 41.27,14.35 42.55,14.35 43.18,13.72 47.37,13.72 49.02,12.06 51.82,12.06 | 40.39,21.46 43.31,24.13 | 43.31,24.13 42.16,25.27 PH1.1 | v59.31,19.56 58.8,19.05 v58.8,10.67 | v33.02,13.08 32.64,13.08 v30.23,10.67 | v22.35,7.49 22.99,8.13 v27.05,8.13
ACCINT1  (via drill 0.35 pad 0.35)
  Top 0.203: 16.76,8.76 23.24,8.76 29.72,15.49 v29.72,15.75 | IC1.41 37.48,16.88 36.45,17.91 31.12,17.91 v30.86,18.16
  Top 0.254: 16.76,8.76 16.38,8.38 16.38,7.87 16.64,7.62 U3.11
  Bottom 0.203: v30.86,18.16 30.48,18.16 29.72,17.4 v29.72,15.75
ACCINT2
  Top 0.203: 18.29,8.25 23.49,8.25 27.56,12.32 40.13,12.32 40.77,12.95 41.15,12.95 41.31,12.79 IC1.2
  Top 0.254: U3.9 17.63,7.6 18.29,8.25
BRIGHT_HIGH
  Top 0.203: IC1.39 37.24,17.88 36.7,18.42 33.59,18.42 R1.2
BRIGHT_IN  (via drill 0.35)
  Top 0.203: IC1.27 45.31,22.32 v45.59,22.61
  Top 0.254: 4.03,18.98 T7.A | v35.43,22.48 35.31,22.48 34.8,22.99 33.95,22.99 C18.1
  Top 0.305: R1.1 30.67,21.4 27.69,18.42 17.53,18.42 v13.59,22.35
  Top 0.406: T7.A v3.56,21.34 5.08,22.86 5.08,25.47 R3.1 | R1.1 34.04,21.4 | 34.04,21.4 R4.1 | C18.1 33.91,21.52 34.04,21.4
  Bottom 0.203: v45.59,22.61 43.31,22.61 41.15,20.45 39.37,20.45 37.34,22.48 v35.43,22.48
  Bottom 0.305: v13.59,22.35 4.57,22.35 v3.56,21.34
  Bottom 0.406: T7.A v3.56,21.34
BRIGHT_LOW
  Top 0.203: IC1.38 37.5,18.38 36.7,19.18 34.74,19.18 R4.2
CHARG_STATUS  (via drill 0.35, 0.35 pad 0.35)
  Top 0.203: v44.96,17.4 41.78,17.4 41.76,17.38 IC1.40 | v50.93,12.83 53.09,12.83 53.59,12.32 v54.99,12.32 | v54.99,8.38 53.21,6.6 v53.21,3.17
  Bottom 0.203: v44.96,17.4 49.53,12.83 v50.93,12.83 | v54.99,12.32 v54.99,8.38 | v53.21,3.17 54.1,2.29 U1.5
ENC_A
  Top 0.203: C41.2 12.53,12.03 17.4,16.89 35.94,16.89 36.96,15.88 IC1.43
  Top 0.406: R36.2 11.07,12.13 C41.2
ENC_B
  Top 0.203: IC1.42 37.21,16.38 36.2,17.4 17.53,17.4 11.68,23.24 11.21,23.24 C42.2
  Top 0.406: R37.2 11.07,23.18 C42.2
ENC_SW  (via drill 0.35)
  Top 0.203: 45.34,15.11 v45.21,15.24 45.31,15.14 IC1.10
  Top 0.254: v36.7,19.94 36.07,20.57 36.07,25.15 34.36,26.86 27.69,26.86 C38.2
  Top 0.406: R38.2 24.64,29.02 R49.2 | 24.57,26.92 R38.2 | R38.2 27.69,26.86
  Bottom 0.203: v36.7,19.94 36.7,19.18 37.21,18.67 38.86,18.67 41.91,15.62 44.83,15.62 v45.21,15.24
GND  (via drill 0.35)
  Top 0.203: IC1.23 49.35,18.38 | U3.10 v17.15,8.13
  Top 0.254: U3.7 U3.15 | IC1.8 44.31,10.55 45.72,9.14 45.72,8.04 C24.2
  other vias: 54.86,22.99 70.74,14.1 49.15,19.81 52.2,23.11 55.12,21.21 12.57,25.02 9.78,25.02 12.7,10.29 10.92,8.89 9.4,7.37 13.46,8.38 11.81,1.91 12.57,3.56 14.99,7.37 19.81,3.68 18.67,3.05 85.85,26.42 86.87,26.42 88.9,26.16 90.42,25.91 91.44,28.19 93.22,28.19 93.98,29.72 90.17,30.48 90.68,30.99 88.65,27.18 86.87,30.48 88.65,32.26 86.87,33.53 93.73,26.42 79.63,14.48 94.74,5.97 82.17,23.24 76.71,24.13 80.9,22.99 16.51,4.7 16.51,1.4 19.18,6.73 14.35,4.06 9.65,10.29 34.29,15.11 35.69,16.13 32.38,11.05 33.78,9.91 38.23,5.33 34.16,5.84 38.23,4.19 36.96,2.79 38.23,1.52 39.5,9.14 39.75,8.13 44.58,8.38 44.58,9.78 44.7,6.86 44.45,5.33 45.72,3.81 47.12,23.37 47.75,26.04 48.01,19.81 63.88,21.84 65.28,20.57 63.88,18.67 65.28,17.4 61.34,15.37 61.59,24.89 71.76,13.84 46.23,14.73 47.5,12.45 47.37,11.56 44.58,16.38 43.05,14.99 40.51,14.73 41.53,18.8 46.35,18.67 46.35,17.53 45.09,18.67 44.58,14.61 42.55,13.21 44.58,12.95 42.55,18.8 72.39,30.48 74.8,32.51 74.8,27.43 77.09,33.78 80.26,15.49 49.02,5.08 30.61,19.81 29.97,19.3 45.59,31.24 55.12,26.04 48.01,20.83 55.12,18.92 48.01,23.37 49.15,26.67 50.42,26.16 48.77,34.67 48.77,32.64 41.02,24.26 39.88,25.65 39.24,27.05 35.18,24.38 32.64,24.38 32.77,25.91 29.08,25.53 26.29,25.53 28.83,23.88 31.88,29.46 31.75,28.45 40,19.56 65.15,26.92 18.41,31.5 20.7,31.5 19.69,27.81 21.46,27.81 5.71,16.13 3.56,14.22 3.05,28.32 3.43,7.11 23.37,20.32 66.29,25.02 63.37,25.02 62.36,21.84 63.25,20.7 63.25,17.4 62.61,18.67 61.59,20.7 61.72,17.53 61.09,14.22 73.79,22.61 74.68,21.72 73.79,20.96 64.14,23.88 65.53,23.88 64.9,25.02 62.48,23.88 72.39,31.5 69.85,27.3 66.68,26.92 63.63,29.34 61.34,33.4 66.8,28.83 69.72,28.96 70.1,30.73 70.99,24.38 68.71,24.38 69.85,24.38 91.44,16.64 92.2,16 93.09,16.64 96.27,16.13 96.27,18.16 97.54,15.88 94.74,15.62 93.85,14.73 93.85,13.33 94.87,14.1 93.73,21.46 90.93,23.5 91.19,20.45 93.6,15.88 92.58,20.45 93.22,23.37 93.85,17.4 94.49,22.48 95.38,21.46 96.27,22.48 60.32,10.16 87.88,26.42 87.25,25.53 86.36,25.53 85.85,30.48 90.55,14.35 79.5,8 99.19,6.6 99.19,10.92 97.41,8.89 48.64,7.24 50.16,3.68 56.13,7.62 56.13,9.53 52.83,8.64 59.05,1.14 51.31,1.65 49.15,20.83 53.47,23.37 56.26,13.59 57.91,13.59 62.36,34.04 59.82,34.42 44.7,34.67 69.98,33.15 75.57,33.78 78.23,24 50.04,8.64 46.61,32.51
  pour Top (isolate 0.203, rank 2): 1.02,0.25 100.84,0.25 100.84,35.26 1.02,35.26
  pour Bottom (isolate 0.203, rank 2): 1.02,0.25 100.84,0.25 100.84,35.26 1.02,35.26
IR_IN  (via drill 0.35)
  Top 0.203: IC1.12 46.31,11.22 46.99,10.54 47.62,10.54 49.15,12.06 v52.83,12.06 | IC2.1 14.99,32.89 16.13,34.04 43.31,34.04 44.58,32.77 v44.58,32
  Bottom 0.203: v52.83,12.06 52.58,12.32 52.58,19.69 49.02,24.64 43.69,24.64 42.67,25.65 42.67,30.1 v44.58,32
IR_OUT  (via drill 0.35)
  Top 0.203: IC1.25 46.31,21.29 46.86,21.84 49.02,21.84 v54.86,27.69
  Bottom 0.203: 64.77,32.51 R20.2 63.37,32.51 62.61,31.75 62.61,30.86 61.98,30.23 55.37,30.23 54.86,29.72 v54.86,27.69
J-LINKRX
  Top 0.203: PH1.9 32,32.38 32.64,33.02 42.8,33.02 43.43,32.38 43.43,29.59 44.07,28.96 44.96,28.96 45.59,28.32 45.59,26.16 43.81,24.38 IC1.30
J-LINKTX
  Top 0.203: IC1.31 43.31,24.77 45.22,26.67 45.21,26.68 45.21,28.19 44.83,28.58 43.94,28.58 43.05,29.46 43.05,32.13 42.55,32.64 41.4,32.64 40.89,32.13 PH1.2
LCD_A0  (via drill 0.35)
  Top 0.203: IC1.33 42.31,25.67 v44.58,27.81
  Bottom 0.203: v44.58,27.81 45.09,28.32 45.09,29.08 47.5,31.5 X1.9
LCD_BACKLIGHT_PWM
  Top 0.203: X1.4 58.04,28.32 58.04,16.89 57.53,16.38 IC1.19
LCD_CS  (via drill 0.35)
  Top 0.203: IC1.32 42.81,25.26 v44.58,26.92
  Bottom 0.203: v44.58,26.92 45.59,27.94 45.59,28.83 46.99,30.23 52.32,30.23 X1.7
LCD_MOSI
  Top 0.203: IC1.28 44.81,22.84 45.34,23.37 45.97,23.37 46.61,22.73 48.51,22.73 52.32,26.54 52.32,29.59 52.96,30.23 54.48,30.23 55.75,31.5 X1.5
LCD_RST  (via drill 0.35)
  Top 0.203: IC1.29 44.31,23.99 46.48,26.16 v46.48,28.83
  Bottom 0.203: v46.48,28.83 47.37,29.72 50.29,29.72 X1.10
LCD_SCK
  Top 0.203: IC1.26 45.81,21.3 46.74,22.23 48.77,22.23 53.59,27.05 X1.8
LED_1_PWM  (via drill 0.35)
  Top 0.203: IC1.11 45.81,10.83 46.74,9.91 47.75,9.91 49.28,11.43 60.71,11.43 61.09,11.05 62.86,11.05 63.12,10.79 63.12,10.41 63.37,10.16 v76.07,10.16 | v88.77,18.42 88.9,18.54 U2.2
  Bottom 0.203: v76.07,10.16 83.95,10.16 86.49,12.7 86.49,14.1 88.77,16.38 v88.77,18.42
LED_2_PWM  (via drill 0.35 pad 0.35)
  Top 0.203: IC1.15 58.83,14.38 v59.69,15.24 | v59.56,18.67 59.05,18.67 58.55,19.18 58.55,26.92 59.94,28.32 59.94,33.4 61.34,34.8 84.71,34.8 v85.34,34.16 | v83.44,32.26 83.44,28.7 83.69,28.45 U4.2
  Bottom 0.203: v59.69,15.24 59.69,18.54 v59.56,18.67 | v85.34,34.16 v83.44,32.26
LED_3_PWM_SCL2
  Top 0.203: IC1.21 56.49,17.38 57.4,18.29 57.4,30.23 X1.3
LED_4_PWM_SDA2
  Top 0.203: IC1.22 55.47,17.88 56.13,18.54 X1.6
N$1
  Top 0.61: U4.5 88.65,28.45 89.15,28.96 89.83,28.96 C3.1
N$2
  Top 0.203: R32.2 70.4,13.21 Q5.3
N$3
  Top 0.61: U4.6 87.81,29.39 88.65,30.23 88.65,30.73 90.17,32.26 92.05,32.26 R5.2
  Top 0.813: R5.2 93.19,32.41 97.28,28.32 J2.2
N$4
  Top 0.61: U4.3 84.56,25.3 D2.A
  Top 0.813: L1.1 79.5,25.4 80.26,24.64 D2.A
N$5
  Top 0.813: D2.C 91.88,24.64 C2.1 92.52,24.64 97.16,24.64 97.28,24.51 J2.1
N$6
  Bottom 0.406: T4.2 69.6,20.89 R11.2
N$7
  Bottom 0.254: 62.03,7.27 R7.1
  Bottom 0.61: U1.1 62.03,7.27
  Bottom 0.813: R7.1 64.24,8 T2.3
N$8  (via drill 0.35)
  Top 0.254: R6.1 63.37,4.83 63.75,4.45 v63.75,3.56
  Bottom 0.254: v63.75,3.56 65.41,3.56 65.41,3.48 T2.1
N$9  (via drill 0.35)
  Top 0.254: v58.8,4.83 R6.2
  Bottom 0.254: U1.7 v58.8,4.83
N$10
  Bottom 0.406: R13.2 70.1,15.49 69.09,14.48 67.59,14.48 T5.2
N$11
  Bottom 0.406: T6.2 70.36,17.72 R12.2
N$12
  Top 0.203: R10.1 Q5.1
  Top 0.254: Q5.1 73.22,11.5 72.77,11.05 Q4.3
N$13  (via drill 0.35)
  Top 0.203: Q5.2 R10.2
  Top 0.254: 78.32,9.4 Q3.3 78.19,9.4 78.23,9.65 77.98,9.91 77.34,9.91 76.45,10.79 76.45,12.83 75.89,13.4 R10.2
  Top 0.813: 78.32,9.4 78.32,5.25
  Bottom 0.254: U1.2 63.58,4.83 64.59,5.84 T2.2
  Bottom 0.813: 70.99,6.4 T2.4
  other vias: 67.18,6.98 69.72,4.57 67.18,4.57 67.18,5.84 69.72,6.98 69.72,5.84 67.18,8.64 69.72,8.64 67.18,3.05 69.72,3.05 73.79,8.64 71.63,8.64 73.79,6.98 73.79,5.84 71.63,3.05 73.79,4.57 73.79,3.05 68.45,5.84 68.45,6.98 68.45,8.64 68.45,4.57 68.45,3.05 72.64,8.64 72.77,3.05
  pour Bottom: 80.65,1.27 80.65,5.59 77.47,8.76 75.31,8.76 74.55,9.65 74.55,11.05 73.15,12.45 66.42,12.45 64.01,10.03 64.01,2.16 64.9,1.27
  pour Top: 80.65,1.27 80.65,5.59 77.22,9.02 75.69,9.02 75.18,9.53 75.18,9.91 74.93,10.16 64.52,10.16 64.01,9.78 64.01,2.16 64.9,1.27
N$14  (via drill 0.35)
  Top 0.406: LED3.5 79.98,17.76 80.26,18.03 80.26,19.3 79.5,20.07 78.49,20.07 77.72,20.83 75.69,20.83 74.17,19.3 v74.17,17.76
  Bottom 0.406: 75.52,17.78 LED2.5 v74.17,17.76 72.35,17.76 R12.1
N$15  (via drill 0.35)
  Top 0.406: LED3.4 78.78,16.8 77.47,15.49 v74.17,15.49
  Bottom 0.406: LED2.4 75.48,16.8 v74.17,15.49 R13.1
N$16  (via drill 0.35)
  Top 0.406: LED3.6 78.83,18.71 v77.47,20.07
  Bottom 0.406: R11.1 74.18,20.07 | 74.18,20.07 LED2.6 | v77.47,20.07 74.18,20.07
N$17
  Top 0.406: IC2.3 9.91,30.52 C5.1 10.2,27.66 R14.1
N$18
  cutout Top: 83.19,32.64 75.82,32.64 75.82,25.27 83.19,25.27
  cutout Top: 88.39,22.23 81.03,22.23 81.03,14.86 88.39,14.86
N$19
  Top 0.203: IC1.1 40.81,10.84 40.64,10.67 37.55,10.67 C7.1 37.34,10.88
  Top 0.406: C7.1 37.3,9.61 35.94,8.25 SJ1.1 31.5,6.35 30.61,5.46 J5.1
N$20
  Top 0.406: 95.34,19.05 C11.1
  Top 0.61: U2.5 93.73,18.54 94.23,19.05 95.34,19.05
N$21
  Top 0.406: 97.77,20.45 R23.2 97.82,20.45
  Top 0.61: U2.6 93.27,19.48 94.23,20.45 97.77,20.45
  Top 0.813: J4.2 98.3,14.61 99.95,16.26 99.95,19.56 99.06,20.45 97.82,20.45
N$22
  Top 0.203: IC1.9 44.81,11.07 47.37,8.51 47.37,8.09
  Top 0.254: 47.37,8.09 C24.1 | 47.59,5.43 C25.1
  Top 0.406: 47.59,5.43 C24.1 49.62,9.91 R15.1
N$23
  Top 0.254: U3.2 16.13,2.29 15.75,1.91 C48.1
N$24
  Top 0.406: L2.1 84.71,15.11
  Top 0.61: U2.3 90.02,16.02 D5.A
  Top 0.813: 84.71,15.11 85.34,14.48 87.88,14.48 89.41,16 D5.A
N$25
  Top 0.813: J4.1 92.65,12.06 C10.1 92.14,12.2 D5.C
N$26
  Top 0.406: SJ2.2 SJ3.1 27.05,29.27 R16.1
N$27  (via drill 0.35)
  Top 0.203: IC1.44 40.65,15.38 v40.89,15.62
  Top 0.254: v36.7,21.08 36.7,25.27 34.54,27.43 31.24,27.43 29.59,29.08 R16.2
  Bottom 0.203: v40.89,15.62 40.89,16 38.73,18.16 36.7,18.16 35.81,19.05 35.81,20.19 v36.7,21.08
N$28
  Top 0.254: 39.97,5.12 Q2.3
  Top 0.406: 39.97,5.12 C28.1 R18.1
N$30
  Top 0.203: IC1.6 43.31,10.66 43.56,10.41 43.56,3.11
  Top 0.254: 43.56,3.11 R18.2
N$31
  Top 0.203: IC1.5 42.81,9.45
  Top 0.254: 42.29,8.93 C27.1 42.81,9.45
  Top 0.406: Q2.1 42.12,7.7 42.29,7.87 42.29,8.93
N$32  (via drill 0.35)
  Top 0.203: IC1.3 41.81,13.31 v41.53,13.59
  Bottom 0.203: 35.67,11.28 39.22,11.28 v41.53,13.59
  Bottom 0.254: 35.67,11.28 C30.1
  Bottom 0.406: Q1.4 35.67,11.28
N$33
  Bottom 0.254: 37.5,6.57 R19.1 | Q1.1 35.67,4.85 C29.1
  Bottom 0.406: Q1.1 37.5,6.57
N$34  (via drill 0.35)
  Top 0.203: IC1.4 42.31,10.78 v41.91,10.41
  Bottom 0.203: R19.2 38.03,8.82 39.62,10.41 v41.91,10.41
N$35
  Bottom 0.406: 67,30.23 T3.1 | R21.1 66.97,30.29 T3.1 | T3.1 67,32.13 R20.1
N$37
  Bottom 0.61: T3.2 68.9,32.06 LED1.K
N$39
  Bottom 0.61: R22.1 LED1.A
N$41
  Top 0.254: 81.13,10.12 R24.2 | R24.2 83.05,10.09 R25.1 | Q3.1 80.43,11.89 81.15,11.18 R24.2
N$48
  Top 0.254: J1.3 84.84,5.46 85.47,6.1 85.47,8.06 R30.1 85.41,10.29 R31.2
  Bottom 0.254: U1.4 63.37,2.29 64.77,0.89 84.07,0.89 84.84,1.65 J1.3
N$74
  Top 0.406: SW2.D 25.8,23.8 R38.1
N$75
  Top 0.406: R36.1 9.02,14.61 9.65,15.24 11.28,15.24 SW2.B
N$76
  Top 0.406: R37.1 8.89,20.7 9.4,20.19 11.23,20.19 SW2.A
NRST  (via drill 0.35)
  Top 0.254: IC1.7 43.81,15.62 v43.18,16.26 | v37.46,19.3 37.46,25.78 35.05,28.19 35.05,28.92 C26.1 34.89,29.12 34.54,29.59 33.91,29.59 33.27,30.23 PH1.8
  Bottom 0.254: v43.18,16.26 41.91,16.26 38.86,19.3 v37.46,19.3
PERIP_PWR  (via drill 0.35, 0.35 pad 0.35)
  Top 0.203: R48.1 15.18,28.13 16.51,29.46 16.51,32.38 17.65,33.53 43.05,33.53 43.94,32.64 43.94,31.12 v44.32,30.73 | IC1.20 57.01,16.88 v57.15,17.02
  Top 0.254: v57.15,12.06 61.95,12.06 Q4.1
  Top 0.406: R14.2 14.29,28.19 R48.1
  Bottom 0.203: v57.15,17.02 53.34,17.02 53.09,17.27 53.09,19.81 49.4,25.02 43.94,25.02 43.05,25.91 43.05,29.46 v44.32,30.73
  Bottom 0.254: v57.15,17.02 v57.15,12.06
SCL  (via drill 0.35 pad 0.35)
  Top 0.203: IC1.45 38.21,14.88 v37.85,15.24 | v28.83,10.92 26.03,8.13 26.03,6.16 R8.1 24.64,6.86 19.94,2.16
  Top 0.254: U3.4 17.15,2.29 17.27,2.16 19.94,2.16
  Bottom 0.203: v37.85,15.24 37.08,15.24 35.94,14.1 31.62,14.1 28.83,11.3 v28.83,10.92
SDA  (via drill 0.35, 0.35 pad 0.35)
  Top 0.203: v30.1,11.68 27.94,11.68 v22.35,6.1 20.83,4.57 | IC1.46 37.62,14.38 v37.34,14.61
  Top 0.254: U3.6 20.83,4.57
  Bottom 0.203: v30.1,11.68 32.13,13.72 36.45,13.72 v37.34,14.61 | v22.35,6.1 23.68,6.1 R9.1
STATUS_LED_B_PWM  (via drill 0.35)
  Top 0.203: v61.47,22.86 60.58,21.97 60.58,18.67 57.78,15.88 IC1.18
  Bottom 0.254: v61.47,22.86 67.45,22.86 T4.1
STATUS_LED_G_PWM  (via drill 0.35)
  Top 0.203: v62.23,19.56 58.04,15.37 58.03,15.38 IC1.17
  Bottom 0.254: v62.23,19.56 67.46,19.56 T6.1
STATUS_LED_R_PWM  (via drill 0.35)
  Top 0.203: v61.72,16.51 59.94,16.51 58.31,14.88 IC1.16
  Bottom 0.254: v61.72,16.51 67.45,16.51 T5.1
SWCLK
  Top 0.203: 38.1,19.05 38.27,18.88 IC1.37
  Top 0.254: 38.1,19.05 38.1,26.67 37.08,27.69 PH1.5
SWDIO
  Top 0.203: IC1.34 41.81,26.39 39.88,28.32 39.88,28.51 R43.2
  Top 0.254: 39.62,28.89 R43.2
  Top 0.406: PH1.3 39.62,28.89
V_BAT
  Top 0.203: R32.1 67.31,13.27 R33.2 64.92,13.37 C37.1 62.45,12.95 53.72,12.95 53.3,13.38 IC1.13
V_PWR  (via drill 0.35)
  Top 0.203: IC1.14 53.94,13.88 v54.23,13.59 | v54.23,8.51 52.96,7.24 R17.2
  Top 0.254: R17.2 51.9,7.14 C6.1 51.94,5.04 51.94,3.56 52.96,2.54 R2.1
  Bottom 0.203: v54.23,13.59 v54.23,8.51